# Altium project Elkapod_power_supply.PrjPcb (part 6 of 6)
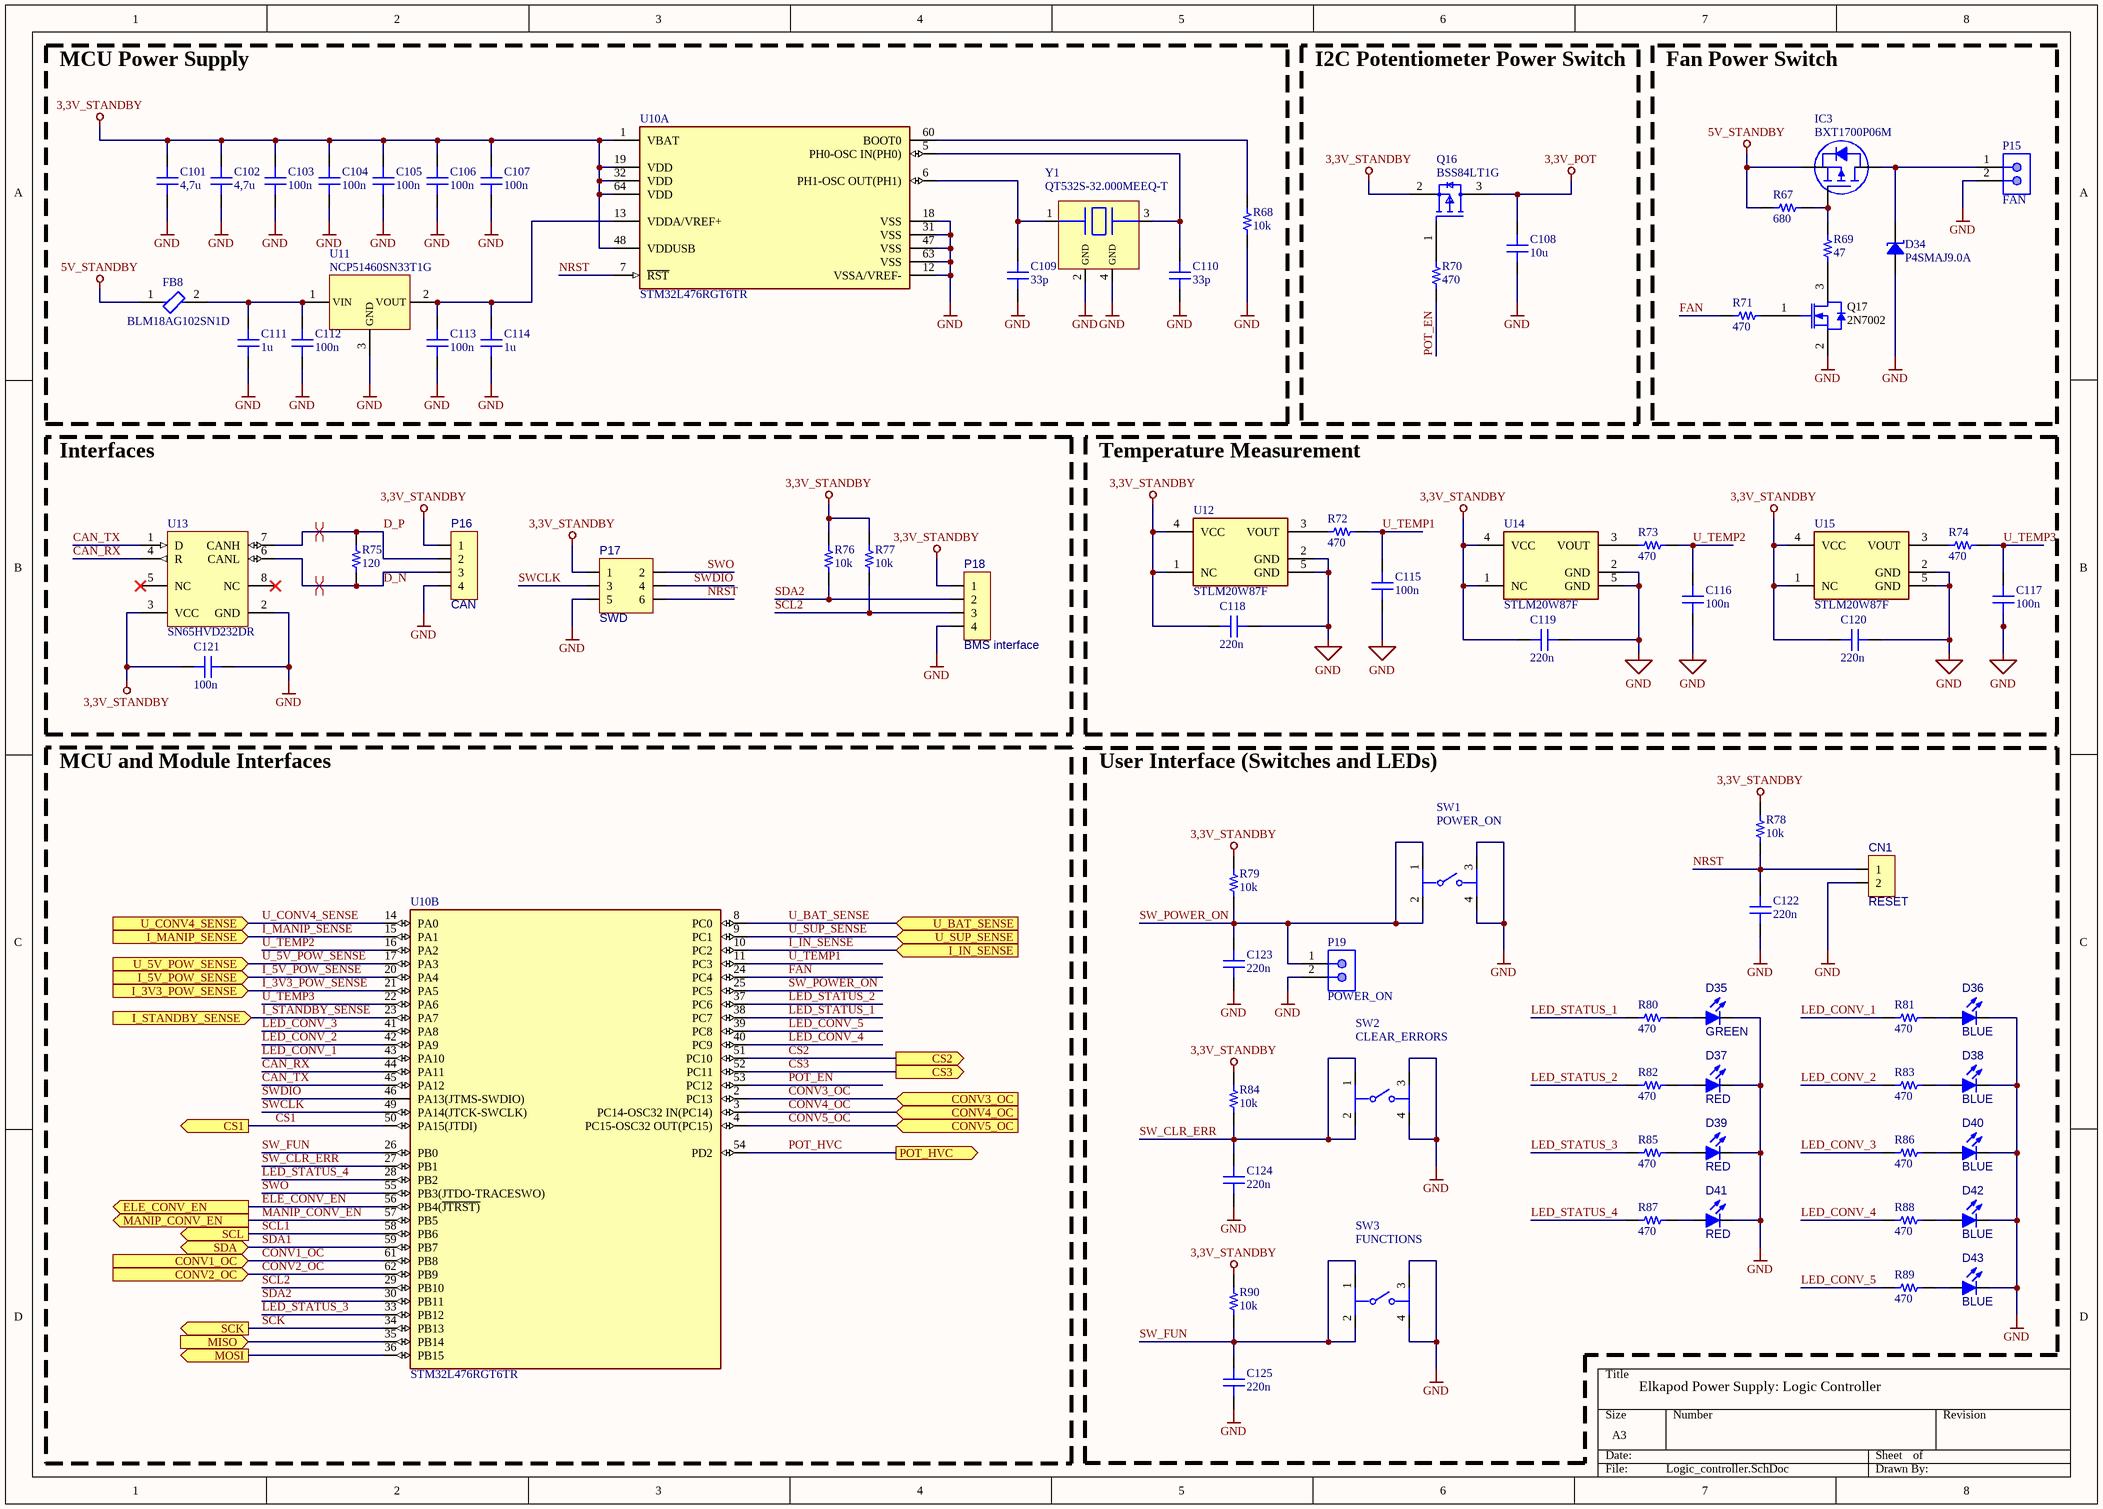
[diagram p10: Logic_controller.SchDoc]

## Nets that join several sheets
3,3V: U_Servos_DC_converter (R52_1.1), U_Servos_DC_converter (R52_2.1), U_Servos_DC_converter (R52_3.1), U_Servos_DC_converter (R52_4.1)
3,3V_POT: U_Servos_DC_converter (C73_1#2.2 U6_1.8), U_Servos_DC_converter (C73_2#2.2 U6_2.8), U_Servos_DC_converter (C73_3#2.2 U6_3.8), U_Servos_DC_converter (C73_4#2.2 U6_4.8), Logic_controller (C108.2 Q16#2.3)
3,3V_STANDBY: StandBy_converter (7 pins), U_Servos_controller (5 pins), U_Servos_controller/U_Servo_control_module? (Q7_1#1.1 R46_1#1.2), U_Servos_controller/U_Servo_control_module? (Q7_2#1.1 R46_2#1.2), U_Servos_controller/U_Servo_control_module? (Q7_3#1.1 R46_3#1.2), U_Servos_controller/U_Servo_control_module? (Q7_4#1.1 R46_4#1.2), U_Servos_controller/U_Servo_control_module? (Q7_5.1 R46_5.2), U_Servos_controller/U_Servo_control_module? (Q7_6.1 R46_6.2), Electronics_power_supply_DC_converter (R17.1), Controllable_voltage_outputs (C134.2 R100.1 U20.16), U_Servos_controller (5 pins), U_Servos_controller/U_Servo_control_module? (Q7_7.1 R46_7.2), U_Servos_controller/U_Servo_control_module? (Q7_8.1 R46_8.2), U_Servos_controller/U_Servo_control_module? (Q7_9.1 R46_9.2), U_Servos_controller/U_Servo_control_module? (Q7_10.1 R46_10.2), U_Servos_controller/U_Servo_control_module? (Q7_11.1 R46_11.2), U_Servos_controller/U_Servo_control_module? (Q7_12.1 R46_12.2), U_Servos_controller (5 pins), U_Servos_controller/U_Servo_control_module? (Q7_13.1 R46_13.2), U_Servos_controller/U_Servo_control_module? (Q7_14.1 R46_14.2), U_Servos_controller/U_Servo_control_module? (Q7_15.1 R46_15.2), U_Servos_controller/U_Servo_control_module? (Q7_16.1 R46_16.2), U_Servos_controller/U_Servo_control_module? (Q7_17.1 R46_17.2), U_Servos_controller/U_Servo_control_module? (Q7_18.1 R46_18.2), Logic_controller (33 pins)
3,3VC: U_Power_sources_selector/U_Current_measurement_circuit (C137_1.2 U20_1.3), U_StandBy_converter/U_Current_measurement_circuit? (C137_2.2 U20_2.3), U_Servos_controller/U_Servo_control_module?/U_Current_measurement_circuit? (C137_3.2 U20_3.3), U_Servos_controller/U_Servo_control_module?/U_Current_measurement_circuit? (C137_4.2 U20_4.3), U_Servos_controller/U_Servo_control_module?/U_Current_measurement_circuit? (C137_5.2 U20_5.3), U_Servos_controller/U_Servo_control_module?/U_Current_measurement_circuit? (C137_6.2 U20_6.3), U_Servos_controller/U_Servo_control_module?/U_Current_measurement_circuit? (C137_7.2 U20_7.3), U_Servos_controller/U_Servo_control_module?/U_Current_measurement_circuit? (C137_8.2 U20_8.3), U_Servos_DC_converter (R46_1#2.1 R51_1.2), U_Electronics_power_supply_DC_converter/U_Current_measurement_circuit (C137_9.2 U20_9.3), U_Electronics_power_supply_DC_converter/U_Current_measurement_circuit (C137_10.2 U20_10.3), U_Current_measurement_circuit (C137_11.2 U20_11.3), U_Servos_controller/U_Servo_control_module?/U_Current_measurement_circuit? (C137_12.2 U20_12.3), U_Servos_controller/U_Servo_control_module?/U_Current_measurement_circuit? (C137_13.2 U20_13.3), U_Servos_controller/U_Servo_control_module?/U_Current_measurement_circuit? (C137_14.2 U20_14.3), U_Servos_controller/U_Servo_control_module?/U_Current_measurement_circuit? (C137_15.2 U20_15.3), U_Servos_controller/U_Servo_control_module?/U_Current_measurement_circuit? (C137_16.2 U20_16.3), U_Servos_controller/U_Servo_control_module?/U_Current_measurement_circuit? (C137_17.2 U20_17.3), U_Servos_controller/U_Servo_control_module?/U_Current_measurement_circuit? (C137_18.2 U20_18.3), U_Servos_controller/U_Servo_control_module?/U_Current_measurement_circuit? (C137_19.2 U20_19.3), U_Servos_controller/U_Servo_control_module?/U_Current_measurement_circuit? (C137_20.2 U20_20.3), U_Servos_controller/U_Servo_control_module?/U_Current_measurement_circuit? (C137_21.2 U20_21.3), U_Servos_controller/U_Servo_control_module?/U_Current_measurement_circuit? (C137_22.2 U20_22.3), U_Servos_controller/U_Servo_control_module?/U_Current_measurement_circuit? (C137_23.2 U20_23.3), U_Servos_DC_converter (R46_2#2.1 R51_2.2), U_Servos_DC_converter (R46_3#2.1 R51_3.2), U_Servos_DC_converter (R46_4#2.1 R51_4.2)
5V_STANDBY: StandBy_converter (5 pins), U_StandBy_converter/U_Current_measurement_circuit? (R123_2.1 U20_2.5), U_Servos_controller (FB9_1.1), U_Servos_controller (FB9_2.1), U_Servos_controller (FB9_3.1), Logic_controller (FB8.1 IC3.2 R67#2.1)
9V: StandBy_converter (C77.2 U7.1), U_Servos_DC_converter (Q7_1#2.2 R43_1.1), U_Servos_DC_converter (Q7_2#2.2 R43_2.1), U_Servos_DC_converter (Q7_3#2.2 R43_3.1), U_Servos_DC_converter (Q7_4#2.2 R43_4.1)
AGND: Elkapod_power_supply (6 pins), Power_sources_selector (17 pins), U_Power_sources_selector/U_Current_measurement_circuit (C136_1.1 C137_1.1 U20_1.1 U20_1.2), StandBy_converter (32 pins), U_StandBy_converter/U_Current_measurement_circuit? (C136_2.1 C137_2.1 U20_2.1 U20_2.2), U_Servos_controller (19 pins), U_Servos_controller/U_Servo_control_module? (7 pins), U_Servos_controller/U_Servo_control_module?/U_Current_measurement_circuit? (C136_3.1 C137_3.1 U20_3.1 U20_3.2), U_Servos_controller/U_Servo_control_module? (7 pins), U_Servos_controller/U_Servo_control_module?/U_Current_measurement_circuit? (C136_4.1 C137_4.1 U20_4.1 U20_4.2), U_Servos_controller/U_Servo_control_module? (7 pins), U_Servos_controller/U_Servo_control_module?/U_Current_measurement_circuit? (C136_5.1 C137_5.1 U20_5.1 U20_5.2), U_Servos_controller/U_Servo_control_module? (7 pins), U_Servos_controller/U_Servo_control_module?/U_Current_measurement_circuit? (C136_6.1 C137_6.1 U20_6.1 U20_6.2), U_Servos_controller/U_Servo_control_module? (7 pins), U_Servos_controller/U_Servo_control_module?/U_Current_measurement_circuit? (C136_7.1 C137_7.1 U20_7.1 U20_7.2), U_Servos_controller/U_Servo_control_module? (7 pins), U_Servos_controller/U_Servo_control_module?/U_Current_measurement_circuit? (C136_8.1 C137_8.1 U20_8.1 U20_8.2), U_Servos_DC_converter (46 pins), Electronics_power_supply_DC_converter (70 pins), U_Electronics_power_supply_DC_converter/U_Current_measurement_circuit (C136_9.1 C137_9.1 U20_9.1 U20_9.2), U_Electronics_power_supply_DC_converter/U_Current_measurement_circuit (C136_10.1 C137_10.1 U20_10.1 U20_10.2), Controllable_voltage_outputs (23 pins), U_Current_measurement_circuit (C136_11.1 C137_11.1 U20_11.1 U20_11.2), U_Servos_controller (19 pins), U_Servos_controller/U_Servo_control_module? (7 pins), U_Servos_controller/U_Servo_control_module?/U_Current_measurement_circuit? (C136_12.1 C137_12.1 U20_12.1 U20_12.2), U_Servos_controller/U_Servo_control_module? (7 pins), U_Servos_controller/U_Servo_control_module?/U_Current_measurement_circuit? (C136_13.1 C137_13.1 U20_13.1 U20_13.2), U_Servos_controller/U_Servo_control_module? (7 pins), U_Servos_controller/U_Servo_control_module?/U_Current_measurement_circuit? (C136_14.1 C137_14.1 U20_14.1 U20_14.2), U_Servos_controller/U_Servo_control_module? (7 pins), U_Servos_controller/U_Servo_control_module?/U_Current_measurement_circuit? (C136_15.1 C137_15.1 U20_15.1 U20_15.2), U_Servos_controller/U_Servo_control_module? (7 pins), U_Servos_controller/U_Servo_control_module?/U_Current_measurement_circuit? (C136_16.1 C137_16.1 U20_16.1 U20_16.2), U_Servos_controller/U_Servo_control_module? (7 pins), U_Servos_controller/U_Servo_control_module?/U_Current_measurement_circuit? (C136_17.1 C137_17.1 U20_17.1 U20_17.2), U_Servos_controller (19 pins), U_Servos_controller/U_Servo_control_module? (7 pins), U_Servos_controller/U_Servo_control_module?/U_Current_measurement_circuit? (C136_18.1 C137_18.1 U20_18.1 U20_18.2), U_Servos_controller/U_Servo_control_module? (7 pins), U_Servos_controller/U_Servo_control_module?/U_Current_measurement_circuit? (C136_19.1 C137_19.1 U20_19.1 U20_19.2), U_Servos_controller/U_Servo_control_module? (7 pins), U_Servos_controller/U_Servo_control_module?/U_Current_measurement_circuit? (C136_20.1 C137_20.1 U20_20.1 U20_20.2), U_Servos_controller/U_Servo_control_module? (7 pins), U_Servos_controller/U_Servo_control_module?/U_Current_measurement_circuit? (C136_21.1 C137_21.1 U20_21.1 U20_21.2), U_Servos_controller/U_Servo_control_module? (7 pins), U_Servos_controller/U_Servo_control_module?/U_Current_measurement_circuit? (C136_22.1 C137_22.1 U20_22.1 U20_22.2), U_Servos_controller/U_Servo_control_module? (7 pins), U_Servos_controller/U_Servo_control_module?/U_Current_measurement_circuit? (C136_23.1 C137_23.1 U20_23.1 U20_23.2), U_Servos_DC_converter (46 pins), U_Servos_DC_converter (46 pins), U_Servos_DC_converter (46 pins), Logic_controller (64 pins)
3,3V_Vout2: Electronics_power_supply_DC_converter (5 pins), Controllable_voltage_outputs (12 pins)
3,3V_Vout_power: Electronics_power_supply_DC_converter (5 pins), U_Electronics_power_supply_DC_converter/U_Current_measurement_circuit (R123_9.2 U20_9.4)
5V_converter_Vout: Electronics_power_supply_DC_converter (14 pins), U_Electronics_power_supply_DC_converter/U_Current_measurement_circuit (R123_10.2 U20_10.4), Controllable_voltage_outputs (12 pins)
CS1: U_Servos_controller (U17_1.10), Logic_controller (U10.50)
CS2: U_Servos_controller (U17_2.10), Logic_controller (U10.51)
CS3: U_Servos_controller (U17_3.10), Logic_controller (U10.52)
ELE_CONV_EN: Electronics_power_supply_DC_converter (R24.1), Logic_controller (U10.56)
I_3V3_POW_SENSE: U_Electronics_power_supply_DC_converter/U_Current_measurement_circuit (C136_9.2 R124_9.2), Logic_controller (U10.21)
I_5V_POW_SENSE: U_Electronics_power_supply_DC_converter/U_Current_measurement_circuit (C136_10.2 R124_10.2), Logic_controller (U10.20)
I_IN_SENSE: U_Power_sources_selector/U_Current_measurement_circuit (C136_1.2 R124_1.2), Logic_controller (U10.10)
I_MANIP_SENSE: U_Current_measurement_circuit (C136_11.2 R124_11.2), Logic_controller (U10.15)
I_STANDBY_SENSE: U_StandBy_converter/U_Current_measurement_circuit? (C136_2.2 R124_2.2), Logic_controller (U10.23)
MANIP_CONV_EN: U_Servos_DC_converter (R39_4.1), Logic_controller (U10.57)
MISO: U_Servos_controller (U17_1.12), U_Servos_controller (U17_2.12), U_Servos_controller (U17_3.12), Logic_controller (U10.35)
MOSI: U_Servos_controller (U17_1.11), U_Servos_controller (U17_2.11), U_Servos_controller (U17_3.11), Logic_controller (U10.36)
NetC1_2: Elkapod_power_supply (C1.2 C2.1 D1.2 P3.1), U_Current_measurement_circuit (R123_11.1 U20_11.5)
NetC30_2: Electronics_power_supply_DC_converter (C30.2 C31.1 D7.2 P8.1), U_Electronics_power_supply_DC_converter/U_Current_measurement_circuit (R123_9.1 U20_9.5)
NetC72_1#1_2: U_Servos_controller/U_Servo_control_module? (C72_1#1.2 Q8_1#1.5-6-7-8), U_Servos_controller/U_Servo_control_module?/U_Current_measurement_circuit? (R123_3.2 U20_3.4)
NetC72_1#2_2: U_Servos_controller (U17_1.8), U_Servos_DC_converter (C72_1#2.2 D18_1.2 R44_1.2 R48_1#2.1)
NetC72_2#1_2: U_Servos_controller/U_Servo_control_module? (C72_2#1.2 Q8_2#1.5-6-7-8), U_Servos_controller/U_Servo_control_module?/U_Current_measurement_circuit? (R123_4.2 U20_4.4)
NetC72_2#2_2: U_Servos_controller (U17_2.8), U_Servos_DC_converter (C72_2#2.2 D18_2.2 R44_2.2 R48_2#2.1)
NetC72_3#1_2: U_Servos_controller/U_Servo_control_module? (C72_3#1.2 Q8_3#1.5-6-7-8), U_Servos_controller/U_Servo_control_module?/U_Current_measurement_circuit? (R123_5.2 U20_5.4)
NetC72_3#2_2: U_Servos_controller (U17_3.8), U_Servos_DC_converter (C72_3#2.2 D18_3.2 R44_3.2 R48_3#2.1)
NetC72_4#1_2: U_Servos_controller/U_Servo_control_module? (C72_4#1.2 Q8_4#1.5-6-7-8), U_Servos_controller/U_Servo_control_module?/U_Current_measurement_circuit? (R123_6.2 U20_6.4)
NetC72_5_2: U_Servos_controller/U_Servo_control_module? (C72_5.2 Q8_5.5-6-7-8), U_Servos_controller/U_Servo_control_module?/U_Current_measurement_circuit? (R123_7.2 U20_7.4)
NetC72_6_2: U_Servos_controller/U_Servo_control_module? (C72_6.2 Q8_6.5-6-7-8), U_Servos_controller/U_Servo_control_module?/U_Current_measurement_circuit? (R123_8.2 U20_8.4)
NetC72_7_2: U_Servos_controller/U_Servo_control_module? (C72_7.2 Q8_7.5-6-7-8), U_Servos_controller/U_Servo_control_module?/U_Current_measurement_circuit? (R123_12.2 U20_12.4)
NetC72_8_2: U_Servos_controller/U_Servo_control_module? (C72_8.2 Q8_8.5-6-7-8), U_Servos_controller/U_Servo_control_module?/U_Current_measurement_circuit? (R123_13.2 U20_13.4)
NetC72_9_2: U_Servos_controller/U_Servo_control_module? (C72_9.2 Q8_9.5-6-7-8), U_Servos_controller/U_Servo_control_module?/U_Current_measurement_circuit? (R123_14.2 U20_14.4)
NetC72_10_2: U_Servos_controller/U_Servo_control_module? (C72_10.2 Q8_10.5-6-7-8), U_Servos_controller/U_Servo_control_module?/U_Current_measurement_circuit? (R123_15.2 U20_15.4)
NetC72_11_2: U_Servos_controller/U_Servo_control_module? (C72_11.2 Q8_11.5-6-7-8), U_Servos_controller/U_Servo_control_module?/U_Current_measurement_circuit? (R123_16.2 U20_16.4)
NetC72_12_2: U_Servos_controller/U_Servo_control_module? (C72_12.2 Q8_12.5-6-7-8), U_Servos_controller/U_Servo_control_module?/U_Current_measurement_circuit? (R123_17.2 U20_17.4)
NetC72_13_2: U_Servos_controller/U_Servo_control_module? (C72_13.2 Q8_13.5-6-7-8), U_Servos_controller/U_Servo_control_module?/U_Current_measurement_circuit? (R123_18.2 U20_18.4)
NetC72_14_2: U_Servos_controller/U_Servo_control_module? (C72_14.2 Q8_14.5-6-7-8), U_Servos_controller/U_Servo_control_module?/U_Current_measurement_circuit? (R123_19.2 U20_19.4)
NetC72_15_2: U_Servos_controller/U_Servo_control_module? (C72_15.2 Q8_15.5-6-7-8), U_Servos_controller/U_Servo_control_module?/U_Current_measurement_circuit? (R123_20.2 U20_20.4)
NetC72_16_2: U_Servos_controller/U_Servo_control_module? (C72_16.2 Q8_16.5-6-7-8), U_Servos_controller/U_Servo_control_module?/U_Current_measurement_circuit? (R123_21.2 U20_21.4)
NetC72_17_2: U_Servos_controller/U_Servo_control_module? (C72_17.2 Q8_17.5-6-7-8), U_Servos_controller/U_Servo_control_module?/U_Current_measurement_circuit? (R123_22.2 U20_22.4)
NetC72_18_2: U_Servos_controller/U_Servo_control_module? (C72_18.2 Q8_18.5-6-7-8), U_Servos_controller/U_Servo_control_module?/U_Current_measurement_circuit? (R123_23.2 U20_23.4)
NetC73_1#1_2: U_Servos_controller/U_Servo_control_module? (C73_1#1.2 C74_1.1 D21_1.2 P11_1.2), U_Servos_controller/U_Servo_control_module?/U_Current_measurement_circuit? (R123_3.1 U20_3.5)
NetC73_2#1_2: U_Servos_controller/U_Servo_control_module? (C73_2#1.2 C74_2.1 D21_2.2 P11_2.2), U_Servos_controller/U_Servo_control_module?/U_Current_measurement_circuit? (R123_4.1 U20_4.5)
NetC73_3#1_2: U_Servos_controller/U_Servo_control_module? (C73_3#1.2 C74_3.1 D21_3.2 P11_3.2), U_Servos_controller/U_Servo_control_module?/U_Current_measurement_circuit? (R123_5.1 U20_5.5)
NetC73_4#1_2: U_Servos_controller/U_Servo_control_module? (C73_4#1.2 C74_4.1 D21_4.2 P11_4.2), U_Servos_controller/U_Servo_control_module?/U_Current_measurement_circuit? (R123_6.1 U20_6.5)
NetC73_5_2: U_Servos_controller/U_Servo_control_module? (C73_5.2 C74_5.1 D21_5.2 P11_5.2), U_Servos_controller/U_Servo_control_module?/U_Current_measurement_circuit? (R123_7.1 U20_7.5)
NetC73_6_2: U_Servos_controller/U_Servo_control_module? (C73_6.2 C74_6.1 D21_6.2 P11_6.2), U_Servos_controller/U_Servo_control_module?/U_Current_measurement_circuit? (R123_8.1 U20_8.5)
NetC73_7_2: U_Servos_controller/U_Servo_control_module? (C73_7.2 C74_7.1 D21_7.2 P11_7.2), U_Servos_controller/U_Servo_control_module?/U_Current_measurement_circuit? (R123_12.1 U20_12.5)
NetC73_8_2: U_Servos_controller/U_Servo_control_module? (C73_8.2 C74_8.1 D21_8.2 P11_8.2), U_Servos_controller/U_Servo_control_module?/U_Current_measurement_circuit? (R123_13.1 U20_13.5)
NetC73_9_2: U_Servos_controller/U_Servo_control_module? (C73_9.2 C74_9.1 D21_9.2 P11_9.2), U_Servos_controller/U_Servo_control_module?/U_Current_measurement_circuit? (R123_14.1 U20_14.5)
NetC73_10_2: U_Servos_controller/U_Servo_control_module? (C73_10.2 C74_10.1 D21_10.2 P11_10.2), U_Servos_controller/U_Servo_control_module?/U_Current_measurement_circuit? (R123_15.1 U20_15.5)
NetC73_11_2: U_Servos_controller/U_Servo_control_module? (C73_11.2 C74_11.1 D21_11.2 P11_11.2), U_Servos_controller/U_Servo_control_module?/U_Current_measurement_circuit? (R123_16.1 U20_16.5)
NetC73_12_2: U_Servos_controller/U_Servo_control_module? (C73_12.2 C74_12.1 D21_12.2 P11_12.2), U_Servos_controller/U_Servo_control_module?/U_Current_measurement_circuit? (R123_17.1 U20_17.5)
NetC73_13_2: U_Servos_controller/U_Servo_control_module? (C73_13.2 C74_13.1 D21_13.2 P11_13.2), U_Servos_controller/U_Servo_control_module?/U_Current_measurement_circuit? (R123_18.1 U20_18.5)
NetC73_14_2: U_Servos_controller/U_Servo_control_module? (C73_14.2 C74_14.1 D21_14.2 P11_14.2), U_Servos_controller/U_Servo_control_module?/U_Current_measurement_circuit? (R123_19.1 U20_19.5)
NetC73_15_2: U_Servos_controller/U_Servo_control_module? (C73_15.2 C74_15.1 D21_15.2 P11_15.2), U_Servos_controller/U_Servo_control_module?/U_Current_measurement_circuit? (R123_20.1 U20_20.5)
NetC73_16_2: U_Servos_controller/U_Servo_control_module? (C73_16.2 C74_16.1 D21_16.2 P11_16.2), U_Servos_controller/U_Servo_control_module?/U_Current_measurement_circuit? (R123_21.1 U20_21.5)
NetC73_17_2: U_Servos_controller/U_Servo_control_module? (C73_17.2 C74_17.1 D21_17.2 P11_17.2), U_Servos_controller/U_Servo_control_module?/U_Current_measurement_circuit? (R123_22.1 U20_22.5)
NetC73_18_2: U_Servos_controller/U_Servo_control_module? (C73_18.2 C74_18.1 D21_18.2 P11_18.2), U_Servos_controller/U_Servo_control_module?/U_Current_measurement_circuit? (R123_23.1 U20_23.5)
NetC82_2: StandBy_converter (9 pins), U_StandBy_converter/U_Current_measurement_circuit? (R123_2.2 U20_2.4)
NetC136_3_2: U_Servos_controller (U17_1.1), U_Servos_controller/U_Servo_control_module?/U_Current_measurement_circuit? (C136_3.2 R124_3.2)
NetC136_4_2: U_Servos_controller (U17_1.2), U_Servos_controller/U_Servo_control_module?/U_Current_measurement_circuit? (C136_4.2 R124_4.2)
NetC136_5_2: U_Servos_controller (U17_1.3), U_Servos_controller/U_Servo_control_module?/U_Current_measurement_circuit? (C136_5.2 R124_5.2)
NetC136_6_2: U_Servos_controller (U17_1.4), U_Servos_controller/U_Servo_control_module?/U_Current_measurement_circuit? (C136_6.2 R124_6.2)
NetC136_7_2: U_Servos_controller (U17_1.5), U_Servos_controller/U_Servo_control_module?/U_Current_measurement_circuit? (C136_7.2 R124_7.2)
NetC136_8_2: U_Servos_controller (U17_1.6), U_Servos_controller/U_Servo_control_module?/U_Current_measurement_circuit? (C136_8.2 R124_8.2)
NetC136_12_2: U_Servos_controller (U17_2.1), U_Servos_controller/U_Servo_control_module?/U_Current_measurement_circuit? (C136_12.2 R124_12.2)
NetC136_13_2: U_Servos_controller (U17_2.2), U_Servos_controller/U_Servo_control_module?/U_Current_measurement_circuit? (C136_13.2 R124_13.2)
NetC136_14_2: U_Servos_controller (U17_2.3), U_Servos_controller/U_Servo_control_module?/U_Current_measurement_circuit? (C136_14.2 R124_14.2)
NetC136_15_2: U_Servos_controller (U17_2.4), U_Servos_controller/U_Servo_control_module?/U_Current_measurement_circuit? (C136_15.2 R124_15.2)
NetC136_16_2: U_Servos_controller (U17_2.5), U_Servos_controller/U_Servo_control_module?/U_Current_measurement_circuit? (C136_16.2 R124_16.2)
NetC136_17_2: U_Servos_controller (U17_2.6), U_Servos_controller/U_Servo_control_module?/U_Current_measurement_circuit? (C136_17.2 R124_17.2)
NetC136_18_2: U_Servos_controller (U17_3.1), U_Servos_controller/U_Servo_control_module?/U_Current_measurement_circuit? (C136_18.2 R124_18.2)
NetC136_19_2: U_Servos_controller (U17_3.2), U_Servos_controller/U_Servo_control_module?/U_Current_measurement_circuit? (C136_19.2 R124_19.2)
NetC136_20_2: U_Servos_controller (U17_3.3), U_Servos_controller/U_Servo_control_module?/U_Current_measurement_circuit? (C136_20.2 R124_20.2)
NetC136_21_2: U_Servos_controller (U17_3.4), U_Servos_controller/U_Servo_control_module?/U_Current_measurement_circuit? (C136_21.2 R124_21.2)
NetC136_22_2: U_Servos_controller (U17_3.5), U_Servos_controller/U_Servo_control_module?/U_Current_measurement_circuit? (C136_22.2 R124_22.2)
NetC136_23_2: U_Servos_controller (U17_3.6), U_Servos_controller/U_Servo_control_module?/U_Current_measurement_circuit? (C136_23.2 R124_23.2)
NetD26_2: Power_sources_selector (D26.2 D28.2 Q12.3 Q14.3), U_Power_sources_selector/U_Current_measurement_circuit (R123_1.2 U20_1.4)
NetF1_1: Elkapod_power_supply (P1.1), Power_sources_selector (F1.1)
NetF2_1: Elkapod_power_supply (P2.1), Power_sources_selector (F2.1)
NetR39_1_1: U_Servos_controller (U18_1.12), U_Servos_DC_converter (R39_1.1)
NetR39_2_1: U_Servos_controller (U18_2.12), U_Servos_DC_converter (R39_2.1)
NetR39_3_1: U_Servos_controller (U18_3.12), U_Servos_DC_converter (R39_3.1)
POT_HVC: U_Servos_DC_converter (D17_1.1 D19_1.1), U_Servos_DC_converter (D17_2.1 D19_2.1), U_Servos_DC_converter (D17_3.1 D19_3.1), U_Servos_DC_converter (D17_4.1 D19_4.1), Logic_controller (U10.54)
SCK: U_Servos_controller (U17_1.13), U_Servos_controller (U17_2.13), U_Servos_controller (U17_3.13), Logic_controller (U10.34)
SCL: U_Servos_controller (U18_1.14), U_Servos_DC_converter (U6_1.2), Controllable_voltage_outputs (U20.14), U_Servos_controller (U18_2.14), U_Servos_controller (U18_3.14), U_Servos_DC_converter (U6_2.2), U_Servos_DC_converter (U6_3.2), U_Servos_DC_converter (U6_4.2), Logic_controller (U10.58)
SDA: U_Servos_controller (U18_1.15), U_Servos_DC_converter (U6_1.3), Controllable_voltage_outputs (U20.15), U_Servos_controller (U18_2.15), U_Servos_controller (U18_3.15), U_Servos_DC_converter (U6_2.3), U_Servos_DC_converter (U6_3.3), U_Servos_DC_converter (U6_4.3), Logic_controller (U10.59)
Servo1_PWM_U_Servos_controller: U_Servos_controller (CN2_1.2), U_Servos_controller/U_Servo_control_module? (Q7_1#1.2 R46_1#1.1)
Servo1_PWM_U_Servos_controller: U_Servos_controller (CN2_2.2), U_Servos_controller/U_Servo_control_module? (Q7_7.2 R46_7.1)
Servo1_PWM_U_Servos_controller: U_Servos_controller (CN2_3.2), U_Servos_controller/U_Servo_control_module? (Q7_13.2 R46_13.1)
Servo2_PWM_U_Servos_controller: U_Servos_controller (CN2_1.4), U_Servos_controller/U_Servo_control_module? (Q7_2#1.2 R46_2#1.1)
Servo2_PWM_U_Servos_controller: U_Servos_controller (CN2_2.4), U_Servos_controller/U_Servo_control_module? (Q7_8.2 R46_8.1)
Servo2_PWM_U_Servos_controller: U_Servos_controller (CN2_3.4), U_Servos_controller/U_Servo_control_module? (Q7_14.2 R46_14.1)
Servo3_PWM_U_Servos_controller: U_Servos_controller (CN2_1.6), U_Servos_controller/U_Servo_control_module? (Q7_3#1.2 R46_3#1.1)
Servo3_PWM_U_Servos_controller: U_Servos_controller (CN2_2.6), U_Servos_controller/U_Servo_control_module? (Q7_9.2 R46_9.1)
Servo3_PWM_U_Servos_controller: U_Servos_controller (CN2_3.6), U_Servos_controller/U_Servo_control_module? (Q7_15.2 R46_15.1)
Servo4_PWM_U_Servos_controller: U_Servos_controller (CN2_1.8), U_Servos_controller/U_Servo_control_module? (Q7_4#1.2 R46_4#1.1)
Servo4_PWM_U_Servos_controller: U_Servos_controller (CN2_2.8), U_Servos_controller/U_Servo_control_module? (Q7_10.2 R46_10.1)
Servo4_PWM_U_Servos_controller: U_Servos_controller (CN2_3.8), U_Servos_controller/U_Servo_control_module? (Q7_16.2 R46_16.1)
Servo5_PWM_U_Servos_controller: U_Servos_controller (CN2_1.10 CN2_1.12), U_Servos_controller/U_Servo_control_module? (Q7_5.2 R46_5.1)
Servo5_PWM_U_Servos_controller: U_Servos_controller (CN2_2.10 CN2_2.12), U_Servos_controller/U_Servo_control_module? (Q7_11.2 R46_11.1)
Servo5_PWM_U_Servos_controller: U_Servos_controller (CN2_3.10 CN2_3.12), U_Servos_controller/U_Servo_control_module? (Q7_17.2 R46_17.1)
servo_converter_Vout: U_Servos_controller/U_Servo_control_module? (5 pins), U_Servos_controller/U_Servo_control_module? (5 pins), U_Servos_controller/U_Servo_control_module? (5 pins), U_Servos_controller/U_Servo_control_module? (5 pins), U_Servos_controller/U_Servo_control_module? (5 pins), U_Servos_controller/U_Servo_control_module? (5 pins), U_Servos_DC_converter (13 pins)
servo_converter_Vout: U_Current_measurement_circuit (R123_11.2 U20_11.4), U_Servos_DC_converter (13 pins)
servo_converter_Vout: U_Servos_controller/U_Servo_control_module? (5 pins), U_Servos_controller/U_Servo_control_module? (5 pins), U_Servos_controller/U_Servo_control_module? (5 pins), U_Servos_controller/U_Servo_control_module? (5 pins), U_Servos_controller/U_Servo_control_module? (5 pins), U_Servos_controller/U_Servo_control_module? (5 pins), U_Servos_DC_converter (13 pins)
servo_converter_Vout: U_Servos_controller/U_Servo_control_module? (5 pins), U_Servos_controller/U_Servo_control_module? (5 pins), U_Servos_controller/U_Servo_control_module? (5 pins), U_Servos_controller/U_Servo_control_module? (5 pins), U_Servos_controller/U_Servo_control_module? (5 pins), U_Servos_controller/U_Servo_control_module? (5 pins), U_Servos_DC_converter (13 pins)
Servo_EN1_U_Servos_controller: U_Servos_controller (U18_1.4), U_Servos_controller/U_Servo_control_module? (R50_1#1.2)
Servo_EN1_U_Servos_controller: U_Servos_controller (U18_2.4), U_Servos_controller/U_Servo_control_module? (R50_7.2)
Servo_EN1_U_Servos_controller: U_Servos_controller (U18_3.4), U_Servos_controller/U_Servo_control_module? (R50_13.2)
Servo_EN2_U_Servos_controller: U_Servos_controller (U18_1.5), U_Servos_controller/U_Servo_control_module? (R50_2#1.2)
Servo_EN2_U_Servos_controller: U_Servos_controller (U18_2.5), U_Servos_controller/U_Servo_control_module? (R50_8.2)
Servo_EN2_U_Servos_controller: U_Servos_controller (U18_3.5), U_Servos_controller/U_Servo_control_module? (R50_14.2)
Servo_EN3_U_Servos_controller: U_Servos_controller (U18_1.6), U_Servos_controller/U_Servo_control_module? (R50_3#1.2)
Servo_EN3_U_Servos_controller: U_Servos_controller (U18_2.6), U_Servos_controller/U_Servo_control_module? (R50_9.2)
Servo_EN3_U_Servos_controller: U_Servos_controller (U18_3.6), U_Servos_controller/U_Servo_control_module? (R50_15.2)
Servo_EN4_U_Servos_controller: U_Servos_controller (U18_1.7), U_Servos_controller/U_Servo_control_module? (R50_4#1.2)
Servo_EN4_U_Servos_controller: U_Servos_controller (U18_2.7), U_Servos_controller/U_Servo_control_module? (R50_10.2)
Servo_EN4_U_Servos_controller: U_Servos_controller (U18_3.7), U_Servos_controller/U_Servo_control_module? (R50_16.2)
Servo_EN5_U_Servos_controller: U_Servos_controller (U18_1.9), U_Servos_controller/U_Servo_control_module? (R50_5.2)
Servo_EN5_U_Servos_controller: U_Servos_controller (U18_2.9), U_Servos_controller/U_Servo_control_module? (R50_11.2)
Servo_EN5_U_Servos_controller: U_Servos_controller (U18_3.9), U_Servos_controller/U_Servo_control_module? (R50_17.2)
Servo_EN6_U_Servos_controller: U_Servos_controller (U18_1.10), U_Servos_controller/U_Servo_control_module? (R50_6.2)
Servo_EN6_U_Servos_controller: U_Servos_controller (U18_2.10), U_Servos_controller/U_Servo_control_module? (R50_12.2)
Servo_EN6_U_Servos_controller: U_Servos_controller (U18_3.10), U_Servos_controller/U_Servo_control_module? (R50_18.2)
U_5V_POW_SENSE: Electronics_power_supply_DC_converter (C7.2 D2.2 R12.2 R13.1), Logic_controller (U10.17)
U_5V_power: Electronics_power_supply_DC_converter (5 pins), U_Electronics_power_supply_DC_converter/U_Current_measurement_circuit (R123_10.1 U20_10.5)
U_BAT_SENSE: Power_sources_selector (C102#1.2 D33.2 R71#1.2 R73#1.1), Logic_controller (U10.8)
U_CONV4_SENSE: U_Servos_DC_converter (C72_4#2.2 D18_4.2 R44_4.2 R48_4#2.1), Logic_controller (U10.14)
U_sup: Elkapod_power_supply (10 pins), Power_sources_selector (C99.2), U_Power_sources_selector/U_Current_measurement_circuit (R123_1.1 U20_1.5), StandBy_converter (8 pins)
U_SUP_SENSE: Power_sources_selector (C101#1.2 D30.2 R65.2 R68#1.1), Logic_controller (U10.9)
Uin: Elkapod_power_supply (R1.1 R2.1), Electronics_power_supply_DC_converter (17 pins)
Uin: Elkapod_power_supply (R3.1 R4.1), U_Servos_DC_converter (18 pins)
Uin: Elkapod_power_supply (R5.1 R6.1), U_Servos_DC_converter (18 pins)
Uin: Elkapod_power_supply (R7.1 R8.1), U_Servos_DC_converter (18 pins)
Uin: Elkapod_power_supply (R9.1 R10.1), U_Servos_DC_converter (18 pins)